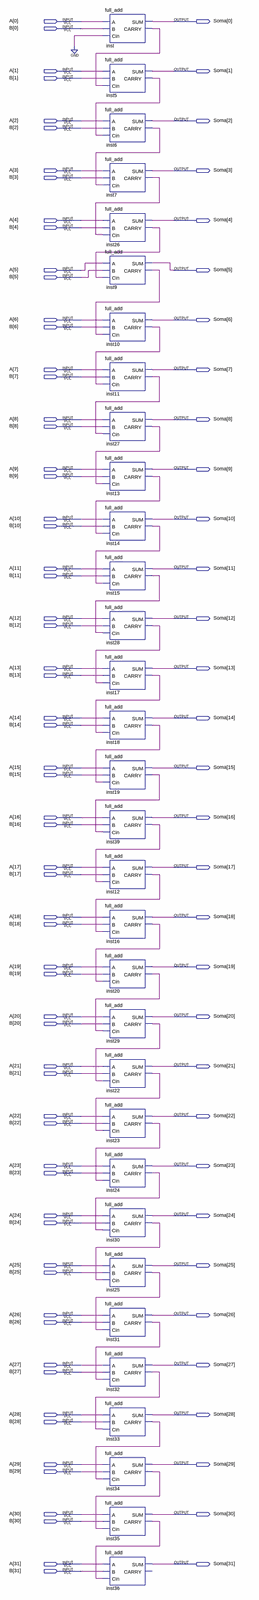
[diagram p0: schematic sheet, whole]
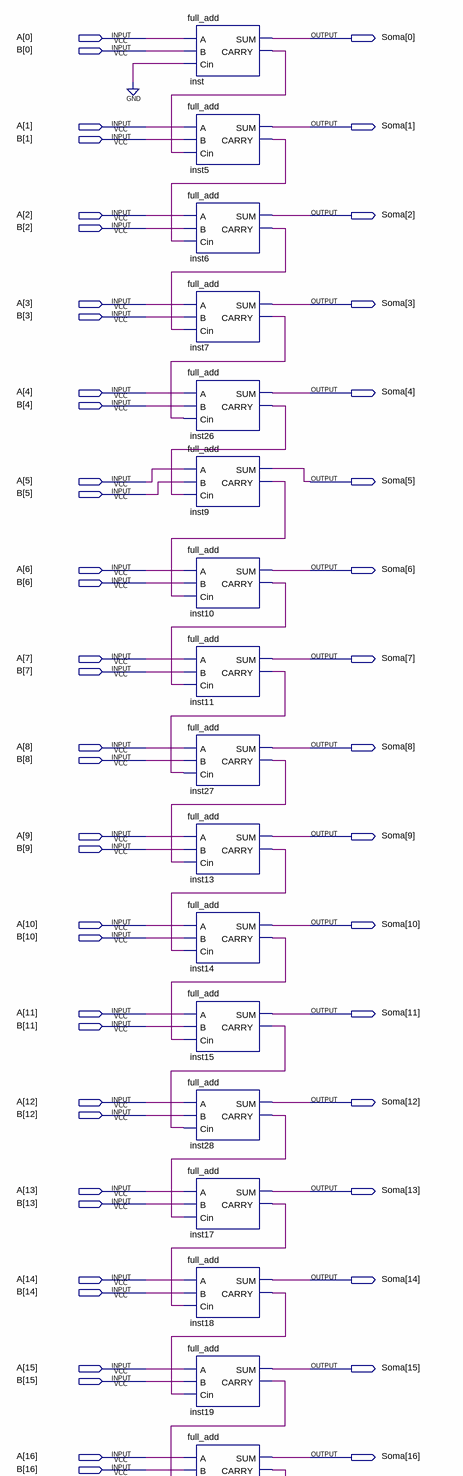
[diagram p1: schematic sheet, upper part]
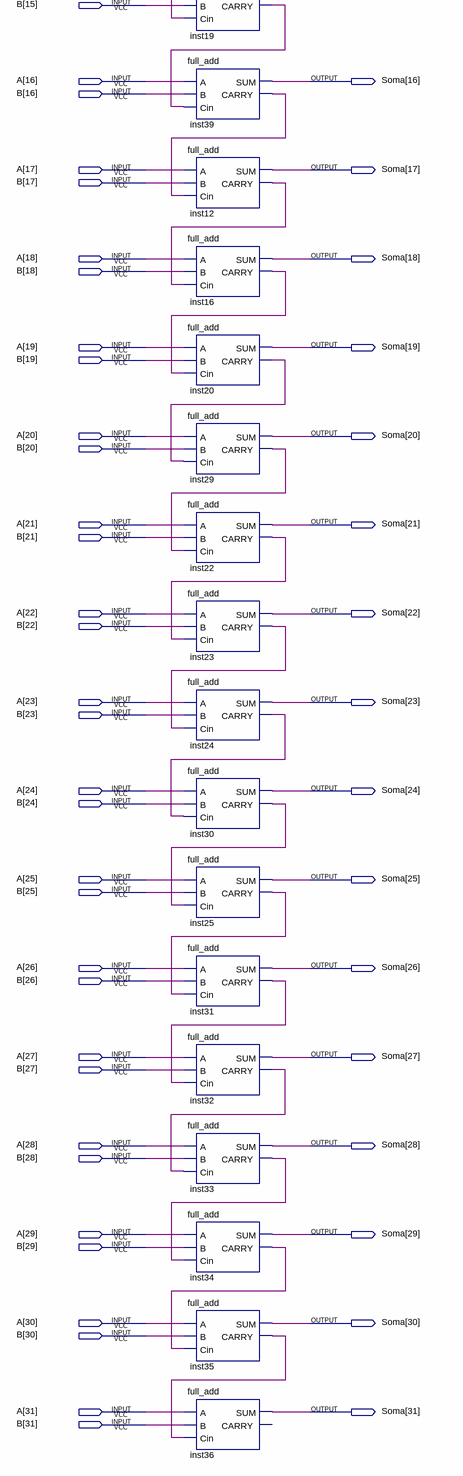
[diagram p2: schematic sheet, lower part]
// Quartus schematic add32.bdf as structural Verilog: 32 symbols, 96 pins
module add32 (
  input  [31:0] A,
  input  [31:0] B,
  output [31:0] Soma
);

  wire inst5_carry, inst6_carry, inst7_carry, inst9_carry, inst10_carry, inst11_carry, inst12_carry,
       inst13_carry, inst14_carry, inst15_carry, inst16_carry, inst17_carry, inst18_carry, inst19_carry,
       inst20_carry, inst22_carry, inst23_carry, inst24_carry, inst25_carry, inst26_carry, inst27_carry,
       inst28_carry, inst29_carry, inst30_carry, inst31_carry, inst32_carry, inst33_carry, inst34_carry,
       inst35_carry, inst39_carry, inst_carry;

  full_add inst (.A(A[0]), .B(B[0]), .Cin(1'b0), .SUM(Soma[0]), .CARRY(inst_carry));
  full_add inst5 (.A(A[1]), .B(B[1]), .Cin(inst_carry), .SUM(Soma[1]), .CARRY(inst5_carry));
  full_add inst6 (.A(A[2]), .B(B[2]), .Cin(inst5_carry), .SUM(Soma[2]), .CARRY(inst6_carry));
  full_add inst7 (.A(A[3]), .B(B[3]), .Cin(inst6_carry), .SUM(Soma[3]), .CARRY(inst7_carry));
  full_add inst26 (.A(A[4]), .B(B[4]), .Cin(inst7_carry), .SUM(Soma[4]), .CARRY(inst26_carry));
  full_add inst9 (.A(A[5]), .B(B[5]), .Cin(inst26_carry), .SUM(Soma[5]), .CARRY(inst9_carry));
  full_add inst10 (.A(A[6]), .B(B[6]), .Cin(inst9_carry), .SUM(Soma[6]), .CARRY(inst10_carry));
  full_add inst11 (.A(A[7]), .B(B[7]), .Cin(inst10_carry), .SUM(Soma[7]), .CARRY(inst11_carry));
  full_add inst27 (.A(A[8]), .B(B[8]), .Cin(inst11_carry), .SUM(Soma[8]), .CARRY(inst27_carry));
  full_add inst13 (.A(A[9]), .B(B[9]), .Cin(inst27_carry), .SUM(Soma[9]), .CARRY(inst13_carry));
  full_add inst14 (.A(A[10]), .B(B[10]), .Cin(inst13_carry), .SUM(Soma[10]), .CARRY(inst14_carry));
  full_add inst15 (.A(A[11]), .B(B[11]), .Cin(inst14_carry), .SUM(Soma[11]), .CARRY(inst15_carry));
  full_add inst28 (.A(A[12]), .B(B[12]), .Cin(inst15_carry), .SUM(Soma[12]), .CARRY(inst28_carry));
  full_add inst17 (.A(A[13]), .B(B[13]), .Cin(inst28_carry), .SUM(Soma[13]), .CARRY(inst17_carry));
  full_add inst18 (.A(A[14]), .B(B[14]), .Cin(inst17_carry), .SUM(Soma[14]), .CARRY(inst18_carry));
  full_add inst19 (.A(A[15]), .B(B[15]), .Cin(inst18_carry), .SUM(Soma[15]), .CARRY(inst19_carry));
  full_add inst39 (.A(A[16]), .B(B[16]), .Cin(inst19_carry), .SUM(Soma[16]), .CARRY(inst39_carry));
  full_add inst12 (.A(A[17]), .B(B[17]), .Cin(inst39_carry), .SUM(Soma[17]), .CARRY(inst12_carry));
  full_add inst16 (.A(A[18]), .B(B[18]), .Cin(inst12_carry), .SUM(Soma[18]), .CARRY(inst16_carry));
  full_add inst20 (.A(A[19]), .B(B[19]), .Cin(inst16_carry), .SUM(Soma[19]), .CARRY(inst20_carry));
  full_add inst29 (.A(A[20]), .B(B[20]), .Cin(inst20_carry), .SUM(Soma[20]), .CARRY(inst29_carry));
  full_add inst22 (.A(A[21]), .B(B[21]), .Cin(inst29_carry), .SUM(Soma[21]), .CARRY(inst22_carry));
  full_add inst23 (.A(A[22]), .B(B[22]), .Cin(inst22_carry), .SUM(Soma[22]), .CARRY(inst23_carry));
  full_add inst24 (.A(A[23]), .B(B[23]), .Cin(inst23_carry), .SUM(Soma[23]), .CARRY(inst24_carry));
  full_add inst30 (.A(A[24]), .B(B[24]), .Cin(inst24_carry), .SUM(Soma[24]), .CARRY(inst30_carry));
  full_add inst25 (.A(A[25]), .B(B[25]), .Cin(inst30_carry), .SUM(Soma[25]), .CARRY(inst25_carry));
  full_add inst31 (.A(A[26]), .B(B[26]), .Cin(inst25_carry), .SUM(Soma[26]), .CARRY(inst31_carry));
  full_add inst32 (.A(A[27]), .B(B[27]), .Cin(inst31_carry), .SUM(Soma[27]), .CARRY(inst32_carry));
  full_add inst33 (.A(A[28]), .B(B[28]), .Cin(inst32_carry), .SUM(Soma[28]), .CARRY(inst33_carry));
  full_add inst34 (.A(A[29]), .B(B[29]), .Cin(inst33_carry), .SUM(Soma[29]), .CARRY(inst34_carry));
  full_add inst35 (.A(A[30]), .B(B[30]), .Cin(inst34_carry), .SUM(Soma[30]), .CARRY(inst35_carry));
  full_add inst36 (.A(A[31]), .B(B[31]), .Cin(inst35_carry), .SUM(Soma[31]));  // open: CARRY
endmodule
